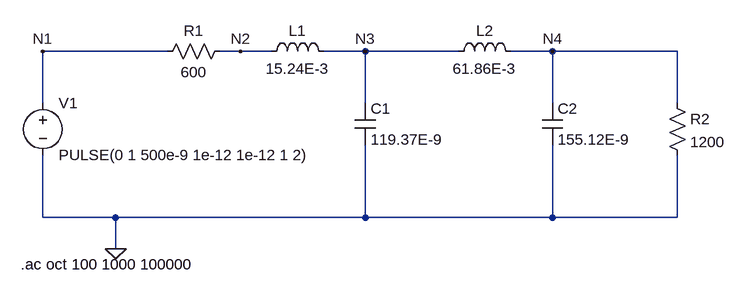
[diagram p0: schematic LRC Time Dependent.asc]
LRC Time Dependent.asc, the LTspice schematic file:
Version 4
SHEET 1 1044 680
WIRE 176 96 -16 96
WIRE 288 96 256 96
WIRE 336 96 288 96
WIRE 480 96 416 96
WIRE 624 96 480 96
WIRE 768 96 704 96
WIRE 960 96 768 96
WIRE -16 176 -16 96
WIRE 480 176 480 96
WIRE 768 176 768 96
WIRE 960 176 960 96
WIRE -16 352 -16 256
WIRE 96 352 -16 352
WIRE 480 352 480 240
WIRE 480 352 96 352
WIRE 768 352 768 240
WIRE 768 352 480 352
WIRE 960 352 960 256
WIRE 960 352 768 352
WIRE 96 400 96 352
FLAG 96 400 0
FLAG -16 96 N1
FLAG 288 96 N2
FLAG 480 96 N3
FLAG 768 96 N4
SYMBOL res 272 80 R90
WINDOW 0 0 56 VBottom 2
WINDOW 3 32 56 VTop 2
SYMATTR InstName R1
SYMATTR Value 600
SYMBOL ind 320 112 R270
WINDOW 0 32 56 VTop 2
WINDOW 3 5 56 VBottom 2
SYMATTR InstName L1
SYMATTR Value 15.24E-3
SYMBOL cap 464 176 R0
SYMATTR InstName C1
SYMATTR Value 119.37E-9
SYMBOL ind 608 112 R270
WINDOW 0 32 56 VTop 2
WINDOW 3 5 56 VBottom 2
SYMATTR InstName L2
SYMATTR Value 61.86E-3
SYMBOL cap 752 176 R0
SYMATTR InstName C2
SYMATTR Value 155.12E-9
SYMBOL res 944 160 R0
SYMATTR InstName R2
SYMATTR Value 1200
SYMBOL voltage -16 160 R0
WINDOW 123 0 0 Left 0
WINDOW 39 0 0 Left 0
SYMATTR InstName V1
SYMATTR Value PULSE(0 1 500e-9 1e-12 1e-12 1 2)
TEXT -50 424 Left 2 !.ac oct 100 1000 100000

The netlist it stands for:
* LRC Time Dependent.asc
R1 N2 N1 600
L1 N2 N3 15.24E-3
C1 N3 0 119.37E-9
L2 N3 N4 61.86E-3
C2 N4 0 155.12E-9
R2 N4 0 1200
V1 N1 0 PULSE(0 1 500e-9 1e-12 1e-12 1 2)
.ac oct 100 1000 100000
.backanno
.end